# Altium project LimeKEY-RPCM_1v1.PrjPcb (part 12 of 12)
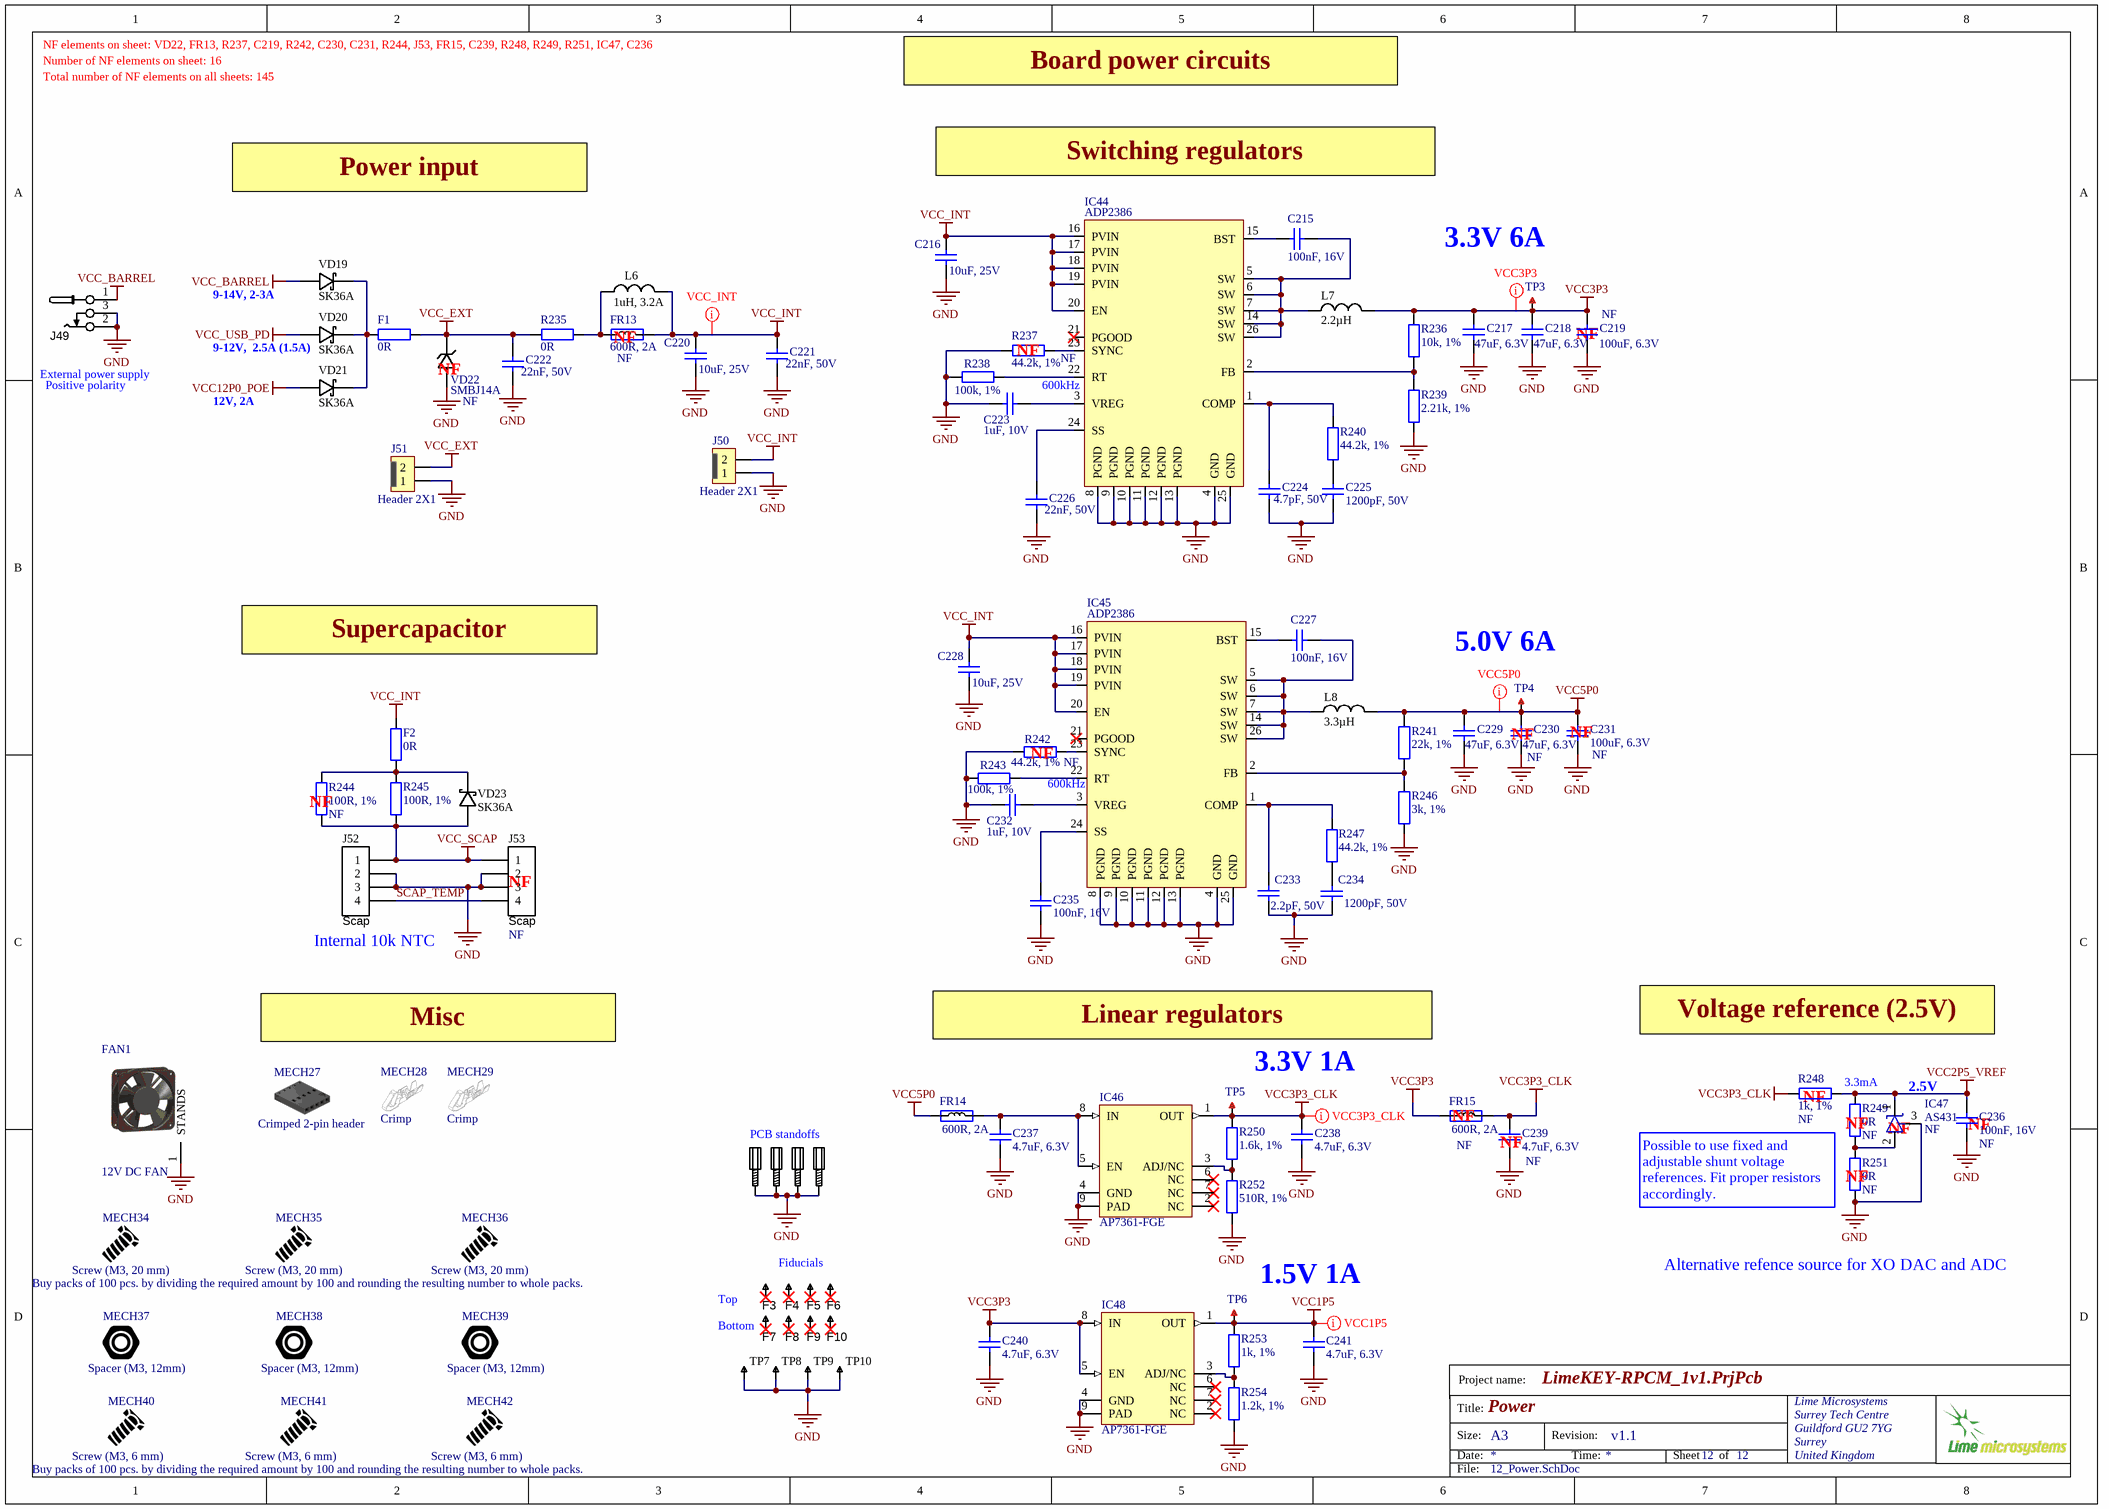
[diagram p112: 12_Power.SchDoc]

## Nets that join several sheets
GND: 05_RPi_mPCIe (80 pins), 06_Misc_1 (92 pins), 07_Misc_2 (71 pins), 08_USB (74 pins), 09_Clock (76 pins), 10_RFFE (116 pins), 11_PoE_USB_PD (30 pins), 12_Power (73 pins)
USB_VBUS_IN: 08_USB (6 pins), 11_PoE_USB_PD (7 pins)
VCC1P5: 05_RPi_mPCIe (J3.6 J3.28 J3.48), 12_Power (C241.2 IC48.1 R253.2 TP6.1)
VCC1P8_RPI: 05_RPi_mPCIe (C4.2 J1.88 J1.90), 06_Misc_1 (5 pins)
VCC2P5_VREF: 07_Misc_2 (R49.1), 09_Clock (R152.2), 12_Power (C236.2 IC47.1 R248.1 R249.1)
VCC3P3: 05_RPi_mPCIe (7 pins), 06_Misc_1 (27 pins), 07_Misc_2 (35 pins), 08_USB (28 pins), 12_Power (10 pins)
VCC3P3_CLK: 09_Clock (12 pins), 12_Power (7 pins)
VCC5P0: 05_RPi_mPCIe (8 pins), 06_Misc_1 (12 pins), 07_Misc_2 (6 pins), 08_USB (13 pins), 10_RFFE (FR9.1 FR10.1), 12_Power (7 pins)
VCC12P0_POE: 07_Misc_2 (R57.1), 11_PoE_USB_PD (7 pins), 12_Power (VD21.A)
VCC_BARREL: 07_Misc_2 (R55.1), 12_Power (J49.1 VD19.A)
VCC_EXT: 07_Misc_2 (R58.1), 12_Power (5 pins)
VCC_INT: 07_Misc_2 (R59.1 R69.1), 12_Power (18 pins)
VCC_SCAP: 07_Misc_2 (R60.1), 12_Power (5 pins)
VCC_USB_PD: 07_Misc_2 (R56.1), 11_PoE_USB_PD (C208.2 IC42.5 IC42.6 IC43.11), 12_Power (VD20.A)
ADF_MUXOUT: 05_RPi_mPCIe (J1.56), 09_Clock (IC27.15 R159.1)
BUZZER: 05_RPi_mPCIe (J1.34), 07_Misc_2 (R82.1 R85.1 VT2.G)
CAM1_CLK_N: 05_RPi_mPCIe (J2.27), 06_Misc_1 (J18.8)
CAM1_CLK_P: 05_RPi_mPCIe (J2.29), 06_Misc_1 (J18.9)
CAM1_D0_N: 05_RPi_mPCIe (J2.15), 06_Misc_1 (J18.2)
CAM1_D0_P: 05_RPi_mPCIe (J2.17), 06_Misc_1 (J18.3)
CAM1_D1_N: 05_RPi_mPCIe (J2.21), 06_Misc_1 (J18.5)
CAM1_D1_P: 05_RPi_mPCIe (J2.23), 06_Misc_1 (J18.6)
CAM1_GPIO0: 05_RPi_mPCIe (J1.97), 06_Misc_1 (J18.11)
DSI1_CLK_N: 05_RPi_mPCIe (J2.87), 06_Misc_1 (J17.5)
DSI1_CLK_P: 05_RPi_mPCIe (J2.89), 06_Misc_1 (J17.6)
DSI1_D0_N: 05_RPi_mPCIe (J2.75), 06_Misc_1 (J17.8)
DSI1_D0_P: 05_RPi_mPCIe (J2.77), 06_Misc_1 (J17.9)
DSI1_D1_N: 05_RPi_mPCIe (J2.81), 06_Misc_1 (J17.2)
DSI1_D1_P: 05_RPi_mPCIe (J2.83), 06_Misc_1 (J17.3)
EN_RXA_LNA: 07_Misc_2 (IC15.1), 10_RFFE (IC40.3 R177.2 R187.1)
EN_RXB_LNA: 07_Misc_2 (IC15.3), 10_RFFE (IC38.3 R175.2 R185.1)
EN_TXA_PA: 07_Misc_2 (IC15.15), 10_RFFE (IC39.3 R176.2 R186.1)
EN_TXB_PA: 07_Misc_2 (IC15.2), 10_RFFE (IC37.3 R174.2 R184.1)
ETH_LED_G: 05_RPi_mPCIe (J1.17), 06_Misc_1 (R26.2)
ETH_LED_Y: 05_RPi_mPCIe (J1.15), 06_Misc_1 (R27.2)
ETH_TRD0_N: 05_RPi_mPCIe (J1.12), 06_Misc_1 (J9.2 VD2.A)
ETH_TRD0_P: 05_RPi_mPCIe (J1.10), 06_Misc_1 (J9.1 VD1.A)
ETH_TRD1_N: 05_RPi_mPCIe (J1.6), 06_Misc_1 (J9.6 VD4.A)
ETH_TRD1_P: 05_RPi_mPCIe (J1.4), 06_Misc_1 (J9.3 VD3.A)
ETH_TRD2_N: 05_RPi_mPCIe (J1.11), 06_Misc_1 (J9.8 VD6.A)
ETH_TRD2_P: 05_RPi_mPCIe (J1.9), 06_Misc_1 (J9.7 VD5.A)
ETH_TRD3_N: 05_RPi_mPCIe (J1.5), 06_Misc_1 (J9.10 VD8.A)
ETH_TRD3_P: 05_RPi_mPCIe (J1.3), 06_Misc_1 (J9.9 VD7.A)
ETH_VC1: 06_Misc_1 (J9.11 J15.2), 11_PoE_USB_PD (BR1.4)
ETH_VC2: 06_Misc_1 (J9.12 J15.1), 11_PoE_USB_PD (BR1.3)
ETH_VC3: 06_Misc_1 (J9.13 J15.4), 11_PoE_USB_PD (BR2.4)
ETH_VC4: 06_Misc_1 (J9.14 J15.3), 11_PoE_USB_PD (BR2.3)
HDMI0_CEC: 05_RPi_mPCIe (J2.51), 06_Misc_1 (J12.13)
HDMI0_CLK_N: 05_RPi_mPCIe (J2.90), 06_Misc_1 (J12.12)
HDMI0_CLK_P: 05_RPi_mPCIe (J2.88), 06_Misc_1 (J12.10)
HDMI0_D0_N: 05_RPi_mPCIe (J2.84), 06_Misc_1 (J12.9)
HDMI0_D0_P: 05_RPi_mPCIe (J2.82), 06_Misc_1 (J12.7)
HDMI0_D1_N: 05_RPi_mPCIe (J2.78), 06_Misc_1 (J12.6)
HDMI0_D1_P: 05_RPi_mPCIe (J2.76), 06_Misc_1 (J12.4)
HDMI0_D2_N: 05_RPi_mPCIe (J2.72), 06_Misc_1 (J12.3)
HDMI0_D2_P: 05_RPi_mPCIe (J2.70), 06_Misc_1 (J12.1)
HDMI0_HOTPLUG: 05_RPi_mPCIe (J2.53), 06_Misc_1 (J12.19)
HDMI0_SCL: 05_RPi_mPCIe (J2.100), 06_Misc_1 (J12.15)
HDMI0_SDA: 05_RPi_mPCIe (J2.99), 06_Misc_1 (J12.16)
HDMI1_CEC: 05_RPi_mPCIe (J2.49), 06_Misc_1 (J13.13)
HDMI1_CLK_N: 05_RPi_mPCIe (J2.66), 06_Misc_1 (J13.12)
HDMI1_CLK_P: 05_RPi_mPCIe (J2.64), 06_Misc_1 (J13.10)
HDMI1_D0_N: 05_RPi_mPCIe (J2.60), 06_Misc_1 (J13.9)
HDMI1_D0_P: 05_RPi_mPCIe (J2.58), 06_Misc_1 (J13.7)
HDMI1_D1_N: 05_RPi_mPCIe (J2.54), 06_Misc_1 (J13.6)
HDMI1_D1_P: 05_RPi_mPCIe (J2.52), 06_Misc_1 (J13.4)
HDMI1_D2_N: 05_RPi_mPCIe (J2.48), 06_Misc_1 (J13.3)
HDMI1_D2_P: 05_RPi_mPCIe (J2.46), 06_Misc_1 (J13.1)
HDMI1_HOTPLUG: 05_RPi_mPCIe (J2.43), 06_Misc_1 (J13.19)
HDMI1_SCL: 05_RPi_mPCIe (J2.47), 06_Misc_1 (J13.15)
HDMI1_SDA: 05_RPi_mPCIe (J2.45), 06_Misc_1 (J13.16)
PCIE_COEX1: 05_RPi_mPCIe (J3.3), 09_Clock (R141.2)
PCIE_PPS_IN: 05_RPi_mPCIe (R1.2 R3.2), 09_Clock (J37.2 R141.1)
PCIE_PPS_OUT: 05_RPi_mPCIe (R2.2 R6.2), 09_Clock (J34.3 J38.1)
PCIE_UIM8: 05_RPi_mPCIe (J3.17), 07_Misc_2 (R40.2)
PCIE_UIMC4: 05_RPi_mPCIe (J3.19), 09_Clock (J39.2)
PCIE_USB_N: 05_RPi_mPCIe (J3.36), 08_USB (R94.1)
PCIE_USB_P: 05_RPi_mPCIe (J3.38), 08_USB (R97.1)
RF_SW_TDD: 07_Misc_2 (J21.2 R40.1 R41.1 R43.1), 10_RFFE (8 pins)
RPI_AIP0: 05_RPi_mPCIe (J1.96), 06_Misc_1 (J14.5)
RPI_AIP1: 05_RPi_mPCIe (J1.94), 06_Misc_1 (J14.6)
RPI_BTN1: 05_RPi_mPCIe (J1.45), 07_Misc_2 (BTN1.1 C52.1 R81.2)
RPI_BTN2: 05_RPi_mPCIe (J1.47), 06_Misc_1 (C9.1 J8.5 R12.2)
RPI_EEPROM_nWP: 05_RPi_mPCIe (J1.20), 06_Misc_1 (J14.4 R28.2)
RPI_GLOBAL_EN: 05_RPi_mPCIe (J1.99 J5.1), 06_Misc_1 (J14.14), 07_Misc_2 (IC17.4)
RPI_GPIO2: 05_RPi_mPCIe (J1.58), 06_Misc_1 (J10.15)
RPI_GPIO4: 05_RPi_mPCIe (J1.54), 06_Misc_1 (J10.16)
RPI_GPIO22: 05_RPi_mPCIe (J1.46), 06_Misc_1 (J10.3)
RPI_GPIO27: 05_RPi_mPCIe (J1.48), 06_Misc_1 (J10.5)
RPI_I2C0_SCL: 05_RPi_mPCIe (J1.80 R9.2), 06_Misc_1 (J17.11 J18.13), 07_Misc_2 (7 pins), 08_USB (R119.2), 11_PoE_USB_PD (R233.2)
RPI_I2C0_SDA: 05_RPi_mPCIe (J1.82 R10.2), 06_Misc_1 (J17.12 J18.14), 07_Misc_2 (7 pins), 08_USB (R118.2), 11_PoE_USB_PD (R232.2)
RPI_ID_SC: 05_RPi_mPCIe (J1.35), 06_Misc_1 (J8.3 J10.18 R17.1)
RPI_ID_SD: 05_RPi_mPCIe (J1.36), 06_Misc_1 (J8.4 J10.17 R13.1)
RPI_LED_nPWR: 05_RPi_mPCIe (J1.95), 06_Misc_1 (IC2.2 R11.2 R14.2)
RPI_nEXTRST: 05_RPi_mPCIe (J1.100), 08_USB (R99.2)
RPI_nRPIBOOT: 05_RPi_mPCIe (J1.93), 06_Misc_1 (J14.2)
RPI_PWM0: 05_RPi_mPCIe (J1.31), 06_Misc_1 (IC6.3)
RPI_PWM1: 05_RPi_mPCIe (J1.28), 06_Misc_1 (IC6.1)
RPI_RF_SW_TDD: 05_RPi_mPCIe (J1.30), 07_Misc_2 (R41.2)
RPI_RUN_PG: 05_RPi_mPCIe (J1.92 J5.3), 06_Misc_1 (IC4.2 R20.2)
RPI_SD_CLK: 05_RPi_mPCIe (J1.57), 06_Misc_1 (J7.5)
RPI_SD_CMD: 05_RPi_mPCIe (J1.62), 06_Misc_1 (J7.3)
RPI_SD_D0: 05_RPi_mPCIe (J1.63), 06_Misc_1 (J7.7)
RPI_SD_D1: 05_RPi_mPCIe (J1.67), 06_Misc_1 (J7.8)
RPI_SD_D2: 05_RPi_mPCIe (J1.69), 06_Misc_1 (J7.1)
RPI_SD_D3: 05_RPi_mPCIe (J1.61), 06_Misc_1 (J7.2)
RPI_SD_PWR_ON: 05_RPi_mPCIe (J1.75), 06_Misc_1 (IC5.3 R21.1)
RPI_SPI0_MISO: 05_RPi_mPCIe (J1.40), 06_Misc_1 (J10.11)
RPI_SPI0_MOSI: 05_RPi_mPCIe (J1.44), 06_Misc_1 (J10.9), 09_Clock (R164.1 R169.2)
RPI_SPI0_SCLK: 05_RPi_mPCIe (J1.38), 06_Misc_1 (J10.13), 09_Clock (R162.1 R168.2)
RPI_SPI0_SS0: 05_RPi_mPCIe (J1.39), 09_Clock (R167.2)
RPI_SPI0_SS1: 05_RPi_mPCIe (J1.37), 09_Clock (R165.1)
RPI_SPI1_MISO: 05_RPi_mPCIe (J1.26), 07_Misc_2 (IC8.12)
RPI_SPI1_MOSI: 05_RPi_mPCIe (J1.27), 07_Misc_2 (IC8.11 IC12.14)
RPI_SPI1_SCLK: 05_RPi_mPCIe (J1.25), 07_Misc_2 (IC8.13 IC12.11 IC15.11)
RPI_SPI1_SS0: 05_RPi_mPCIe (J1.49), 07_Misc_2 (IC8.10)
RPI_SPI1_SS1: 05_RPi_mPCIe (J1.50), 07_Misc_2 (IC12.12 IC15.12)
RPI_STATUS_LED_G: 06_Misc_1 (IC2.4 R14.1), 07_Misc_2 (R86.1 R91.2)
RPI_STATUS_LED_R: 05_RPi_mPCIe (J1.21), 07_Misc_2 (R87.1)
RPI_SYNC_IN: 06_Misc_1 (IC3.4 J14.8 R22.2), 09_Clock (J38.2)
RPI_SYNC_IN_LS: 05_RPi_mPCIe (J1.16), 06_Misc_1 (IC3.3 R22.1)
RPI_SYNC_OUT: 06_Misc_1 (IC1.4 J14.9 R15.1), 09_Clock (J34.5 J36.1 J37.1)
RPI_SYNC_OUT_LS: 05_RPi_mPCIe (J1.18), 06_Misc_1 (IC1.3 R15.2)
RPI_TVDAC: 05_RPi_mPCIe (J2.11), 06_Misc_1 (J14.11 J16.1 J19.4)
RPI_UART0_RX: 05_RPi_mPCIe (J1.51), 06_Misc_1 (J10.10 J11.3)
RPI_UART0_TX: 05_RPi_mPCIe (J1.55), 06_Misc_1 (J10.8 J11.2)
RPI_USB_D_N: 05_RPi_mPCIe (J2.3), 08_USB (IC19.2 R117.2)
RPI_USB_D_P: 05_RPi_mPCIe (J2.5), 08_USB (IC19.1 R116.2)
RPI_USB_OTG_ID: 05_RPi_mPCIe (J2.1), 08_USB (R103.1 R110.2)
SCAP_TEMP: 07_Misc_2 (C37.1 IC8.7 R47.2 R51.1), 12_Power (J52.4 J53.4)
USB_CC1: 08_USB (J27.A5), 11_PoE_USB_PD (C214.1 IC43.15)
USB_CC2: 08_USB (J27.B5), 11_PoE_USB_PD (C213.1 IC43.14)